# Altium schematic sheet Connector.SchDoc
size A4; SheetNumber: 6; SheetTotal: 6; ProjectTitle: DSP_VERSION_1.0
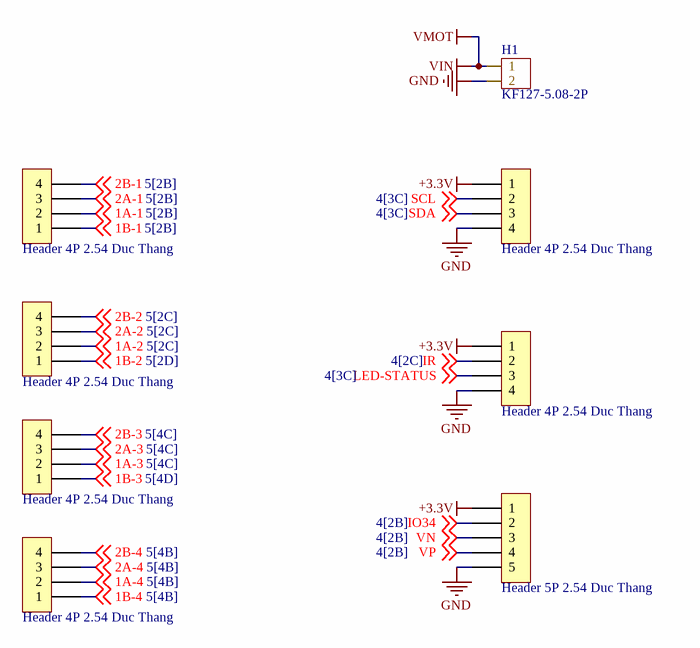
[diagram p0: Connector.SchDoc]

## Parts
H1  KF127-5.08-2P  [KF127-5.08-2P]
H3  Header 4P 2.54 Duc Thang  [XH2.54M-4]
H4  Header 4P 2.54 Duc Thang  [XH2.54M-4]
H5  Header 4P 2.54 Duc Thang  [XH2.54M-4]
H6  Header 4P 2.54 Duc Thang  [XH2.54M-4]
H7  Header 4P 2.54 Duc Thang  [XH2.54M-4]
H8  Header 5P 2.54 Duc Thang  [XH2.54M-5]
H9  Header 4P 2.54 Duc Thang  [XH2.54M-4]

## Nets
+3.3V: H4.1 H6.1 H8.1
GND: H1.2 H4.4 H6.4 H8.5
VIN: H1.1  [also labelled VMOT]
1A-1: H3.2 ; off-sheet 1A-1
1A-2: H5.2 ; off-sheet 1A-2
1A-3: H7.2 ; off-sheet 1A-3
1A-4: H9.2 ; off-sheet 1A-4
1B-1: H3.1 ; off-sheet 1B-1
1B-2: H5.1 ; off-sheet 1B-2
1B-3: H7.1 ; off-sheet 1B-3
1B-4: H9.1 ; off-sheet 1B-4
2A-1: H3.3 ; off-sheet 2A-1
2A-2: H5.3 ; off-sheet 2A-2
2A-3: H7.3 ; off-sheet 2A-3
2A-4: H9.3 ; off-sheet 2A-4
2B-1: H3.4 ; off-sheet 2B-1
2B-2: H5.4 ; off-sheet 2B-2
2B-3: H7.4 ; off-sheet 2B-3
2B-4: H9.4 ; off-sheet 2B-4
IO34: H8.2 ; off-sheet IO34
IR: H6.2 ; off-sheet IR
LED-STATUS: H6.3 ; off-sheet LED-STATUS
SCL: H4.2 ; off-sheet SCL
SDA: H4.3 ; off-sheet SDA
VN: H8.3 ; off-sheet VN
VP: H8.4 ; off-sheet VP

## Notes on the sheet
- Author:
- Title:
- Size:
- A4
- Project:
- Approved:
- Revision:
- Modified Date:
- CONFIDENTIAL
- Date:
- SW Version:

## Library data of the parts
H1 = KF127-5.08-2P: 1.5 1x2P 14~26 Green -40℃~+105℃ 15A 250V Through Hole 5.08mm 1 2 Through Hole,P=5.08mm Wire to Board RoHS; Manufacturer: Cixi Kefa Elec; Key Attributes: TERM BLK 2POS 5.08mm TH; Mfr. Part #: KF127-5.08-2P; LCSC Part #: C474906; Package: Through Hole,P=5.08mm; Link: https://www.lcsc.com/product-detail/C474906.html?s_z=n_kf127
H3-H7 H9 = Header 4P 2.54 Duc Thang: Cắm; Ten_Linh_Kien: Header 4P XH2.54-4P Đực Thẳng; Don_Vi: Con; Ma_Hang: MH001285; Chung_Loai: Cắm
H8 = Header 5P 2.54 Duc Thang: Cắm; Ten_Linh_Kien: Header 5P XH2.54-5P Đực Thẳng; Don_Vi: Con; Ma_Hang: MH001298; Chung_Loai: Cắm